# EAGLE design PowerMeter (EAGLE 7.3.0)
DATABASE: ../../../../digikeydb.txt
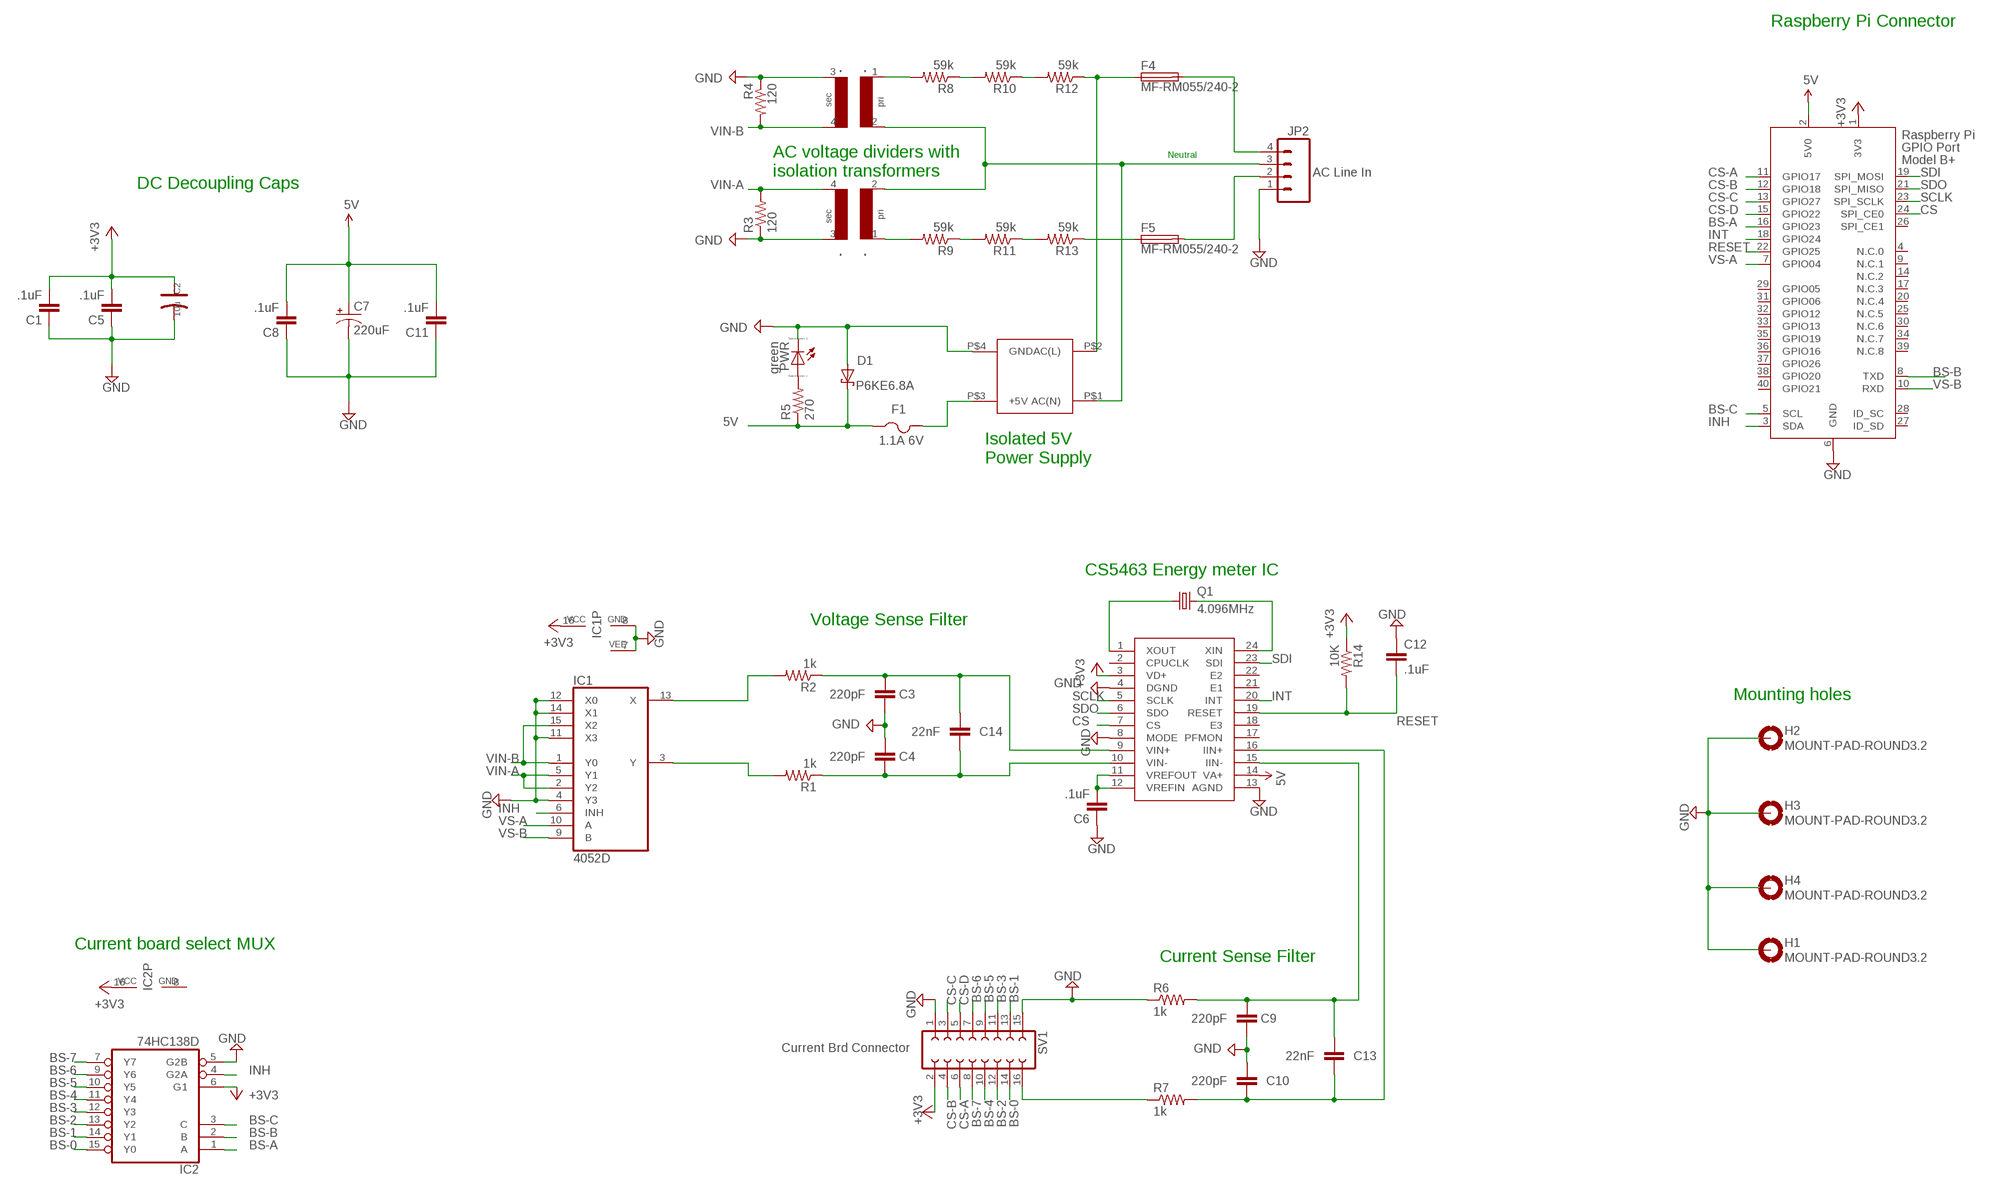
[diagram p0: schematic, sheet 1]

## Parts
C1  .1uF  C-EUC1206  [C1206]
C2  10u  CAP-AVX-C  [AVX-C]
C3  220pF  C-EUC1206  [C1206]
C4  220pF  C-EUC1206  [C1206]
C5  .1uF  C-EUC1206  [C1206]
C6  .1uF  C-EUC1206  [C1206]
C7  220uF  CPOL-USE2,5-6E  [E2,5-6E]
C8  .1uF  C-EUC1206  [C1206]
C9  220pF  C-EUC1206  [C1206]
C10  220pF  C-EUC1206  [C1206]
C11  .1uF  C-EUC1206  [C1206]
C12  .1uF  C-EUC1206  [C1206]
C13  22nF  C-EUC1206  [C1206]
C14  22nF  C-EUC1206  [C1206]
D1  P6KE6.8A  P6KEXXA  [C1702-15]
F1  1.1A 6V  PTCFUSE-1812  [1812]
F4  MF-RM055/240-2  FUSETE5  [TE5]
F5  MF-RM055/240-2  FUSETE5  [TE5]
H1  MOUNT-PAD-ROUND3.2  [3,2-PAD]
H2  MOUNT-PAD-ROUND3.2  [3,2-PAD]
H3  MOUNT-PAD-ROUND3.2  [3,2-PAD]
H4  MOUNT-PAD-ROUND3.2  [3,2-PAD]
IC1  4052D  [SO16]
IC2  74HC138D  [SO16]
JP2  AC Line In  M04  [SCREWTERMINAL-5MM-4]
PWR  green  LED_E  [LED_1206]
Q1  4.096MHz  CRYSTALHC49S  [HC49/S]
R1  1k  R-US_R1206  [R1206]
R2  1k  R-US_R1206  [R1206]
R3  120  R-US_R1206  [R1206]
R4  120  R-US_R1206  [R1206]
R5  270  R-US_R1206  [R1206]
R6  1k  R-US_R1206  [R1206]
R7  1k  R-US_R1206  [R1206]
R8  59k  R-US_R1206  [R1206]
R9  59k  R-US_R1206  [R1206]
R10  59k  R-US_R1206  [R1206]
R11  59k  R-US_R1206  [R1206]
R12  59k  R-US_R1206  [R1206]
R13  59k  R-US_R1206  [R1206]
R14  10K  R-US_R1206  [R1206]
SV1  Current Brd Connector  FE08-2  [FE08-2]
U$2  TV16E  [TV16E]
U$3  TV16E  [TV16E]
U$4  VSK-S10  [VSK-S10]
U$5  CS5463  [SSOP24]
X2  RASPI_BOARD_B+_E4  [RASPI_BOARD_B+_EDGES_4DRILL]

## Nets
5V: C7.+ C8.2 C11.2 D1.C F1.1 R5.1 U$5.14(VA+) X2.2(5V0)
+3V3: C1.2 C2.+ C5.2 IC1.16(VCC) IC2.6(G1) IC2.16(VCC) R14.1 SV1.2 U$5.3(VD+) X2.1(3V3)
+5V: F1.2 U$4.P$3(+5V)
AC1 [ac line]: R8.2 U$3.1
AC(L) [ac line]: F4.1 R12.1 U$4.P$2(AC(L))
AC(N) [ac line]: JP2.3 U$2.2 U$3.2 U$4.P$1(AC(N))
BS-0: IC2.15(Y0) SV1.14
BS-1: IC2.14(Y1) SV1.13
BS-2: IC2.13(Y2) SV1.12
BS-3: IC2.12(Y3) SV1.11
BS-4: IC2.11(Y4) SV1.10
BS-5: IC2.10(Y5) SV1.9
BS-6: IC2.9(Y6) SV1.7
BS-7: IC2.7(Y7) SV1.8
BS-A: IC2.1(A) X2.16(GPIO23)
BS-B: IC2.2(B) X2.8(TXD)
BS-C: IC2.3(C) X2.5(SCL)
C5: C10.1 C13.1 R7.2 U$5.16(IIN+)
CS: U$5.7(CS) X2.24(SPI_CE0)
CS-A: SV1.6 X2.11(GPIO17)
CS-B: SV1.4 X2.12(GPIO18)
CS-C: SV1.3 X2.13(GPIO27)
CS-D: SV1.5 X2.15(GPIO22)
GND: C1.1 C2.- C3.1 C4.2 C5.1 C6.1 C7.- C8.1 C9.1 C10.2 C11.1 C12.1 D1.A H1.B3,2(MOUNT) H2.B3,2(MOUNT) H3.B3,2(MOUNT) H4.B3,2(MOUNT) IC1.4(Y3) IC1.7(VEE) IC1.8(GND) IC1.11(X3) IC1.12(X0) IC1.14(X1) IC2.5(G2B) JP2.1 PWR.C R3.1 R4.1 R6.1 SV1.1 SV1.15 U$2.3 U$3.3 U$4.P$4(GND) U$5.4(DGND) U$5.8(MODE) U$5.13(AGND) X2.6(GND)
IIN+: R7.1 SV1.16
INH: IC1.6(INH) IC2.4(G2A) X2.3(SDA)
INT: U$5.20(INT) X2.18(GPIO24)
N$1: Q1.1 U$5.1(XOUT)
N$2 [ac line]: F5.1 R13.1
N$7: PWR.A R5.2
N$8: C9.2 C13.2 R6.2 U$5.15(IIN-)
N$9 [ac line]: F4.2 JP2.4
N$12: Q1.2 U$5.24(XIN)
N$17: C6.2 U$5.11(VREFOUT) U$5.12(VREFIN)
N$23: IC1.13(X) R2.2
N$38 [ac line]: F5.2 JP2.2
N$39: IC1.3(Y) R1.2
N$43 [ac line]: R10.1 R12.2
N$44 [ac line]: R8.1 R10.2
N$46: C4.1 C14.1 R1.1 U$5.10(VIN-)
N$48 [ac line]: R11.1 R13.2
N$49 [ac line]: R9.1 R11.2
N$51 [ac line]: R9.2 U$2.1
R1: C3.2 C14.2 R2.1 U$5.9(VIN+)
RESET: C12.2 R14.2 U$5.19(RESET) X2.22(GPIO25)
SCLK: U$5.5(SCLK) X2.23(SPI_SCLK)
SDI: U$5.23(SDI) X2.19(SPI_MOSI)
SDO: U$5.6(SDO) X2.21(SPI_MISO)
VIN-A: IC1.2(Y2) IC1.5(Y1) R3.2 U$2.4
VIN-B: IC1.1(Y0) IC1.15(X2) R4.2 U$3.4
VS-A: IC1.10(A) X2.7(GPIO04)
VS-B: IC1.9(B) X2.10(RXD)
Unconnected: U$5.2(CPUCLK) U$5.17(PFMON) U$5.18(E3) U$5.21(E1) U$5.22(E2) X2.4(N.C.0) X2.9(N.C.1) X2.14(N.C.2) X2.17(N.C.3) X2.20(N.C.4) X2.25(N.C.5) X2.26(SPI_CE1) X2.27(ID_SD) X2.28(ID_SC) X2.29(GPIO05) X2.30(N.C.6) X2.31(GPIO06) X2.32(GPIO12) X2.33(GPIO13) X2.34(N.C.7) X2.35(GPIO19) X2.36(GPIO16) X2.37(GPIO26) X2.38(GPIO20) X2.39(N.C.8) X2.40(GPIO21)

## Notes on the sheet
- Raspberry Pi Connector
- Neutral
- AC voltage dividers with
  isolation transformers
- DC Decoupling Caps
- Isolated 5V
  Power Supply
- CS5463 Energy meter IC
- Voltage Sense Filter
- Mounting holes
- Current board select MUX
- Current Sense Filter

## Power pins joined to a net without a drawn wire
GND: IC2.8(GND)

## Library data of the parts
C1 C5 C6 C8 C11 C12 = rcl:C-EU: CAPACITOR, European symbol; PARTNO: C1206C104K5RAC7867
C2 = Discrete:CAP*: Electrolytic Capacitors,Tantalum Capacitors and Super Capacitors; PARTNO: T491C106K016AT
C3 C4 C9 C10 = rcl:C-EU: CAPACITOR, European symbol; PARTNO: C1206C221J5GACTU
C7 = adafruit:CPOL-US: POLARIZED CAPACITOR, American symbol; PARTNO: ESH227M016AE3AA
C13 C14 = rcl:C-EU: CAPACITOR, European symbol; PARTNO: C1206C223K5RACTU
D1 = diode:P6KEXXA: DIODE transient-voltage suppressor; PARTNO: P6KE6.8A
F1 = adafruit:PTCFUSE: PTC fuses, resettable thermistors; PARTNO: 0ZCC0110AF2C
F4 F5 = fuse:FUSE: Fuse; OC_FARNELL: unknown; OC_NEWARK: unknown; PARTNO: MF-RM055/240-2
H1-H4 = holes:MOUNT-PAD-ROUND: MOUNTING PAD, round; BOM: EXCLUDE
IC1 = 40xx:4052: Dual 4-channel ANALOG MULTIPLEXER; PARTNO: CD4052BNSR
IC2 = 74xx-eu:74*138: 3-line to 8-line DECODER/DEMULTIPLEXER; PARTNO: SN74HC138NSR
JP2 = SparkFun-Connectors:M04: Header 4 Standard 4-pin 0.1" header. Use with straight break away headers (SKU : PRT-00116), right angle break away headers (PRT-00553), swiss pins (PRT-00743), machine pins (PRT-00117), and female headers (PRT-00115). Molex polarized connector foot print use with SKU : PRT-08231 with associated crimp pins and housings. 1MM SMD Version SKU: PRT-10208; PARTNO: 1935187
PWR = eagle-ltspice:LED_E: LED Source: http://www.osram.convergy.de Source: www.luxeon.com Source: www.kingbright.com; PARTNO: LTST-C150GKT; SPICEMODEL: NONE; SPICEPREFIX: D; SPICETYPE: diode
Q1 = crystal:CRYSTAL: CRYSTAL; OC_FARNELL: 1667008; OC_NEWARK: unknown; PARTNO: 9B-4.096MBBK-B
R1 R2 R6 R7 = resistor:R-US_: RESISTOR, American symbol; PARTNO: RC1206FR-071KL
R3 R4 = resistor:R-US_: RESISTOR, American symbol; PARTNO: RC1206FR-07120RL
R5 = resistor:R-US_: RESISTOR, American symbol; PARTNO: RC1206FR-07270RL
R8-R13 = resistor:R-US_: RESISTOR, American symbol; PARTNO: RC1206FR-0759KL
R14 = resistor:R-US_: RESISTOR, American symbol; PARTNO: RC1206FR-0710KL
SV1 = con-lsta:FE08-2: FEMALE HEADER; OC_FARNELL: unknown; OC_NEWARK: unknown; PARTNO: PPTC082LFBN-RC
U$2 U$3 = CraigJensen:TV16E: YHDC TV16E Transformer
U$4 = CraigJensen:VSK-S10; PARTNO: VSK-S5-5UA
U$5 = Cirrus_Logic_By_element14_Batch_1:CS5463; PARTNO: CS5463-ISZ
X2 = raspberrypi_bastelstube_v13:RASPI_BOARD_B+: Raspberry Pi GPIO connector with markings for the outer dimensions of the Raspberry Pi board model B+ with different sets of drill holes or mounting pads; PARTNO: M20-9762046

## Net classes
1 ac line: width 0.4 mm, clearance 1.2 mm

## Board
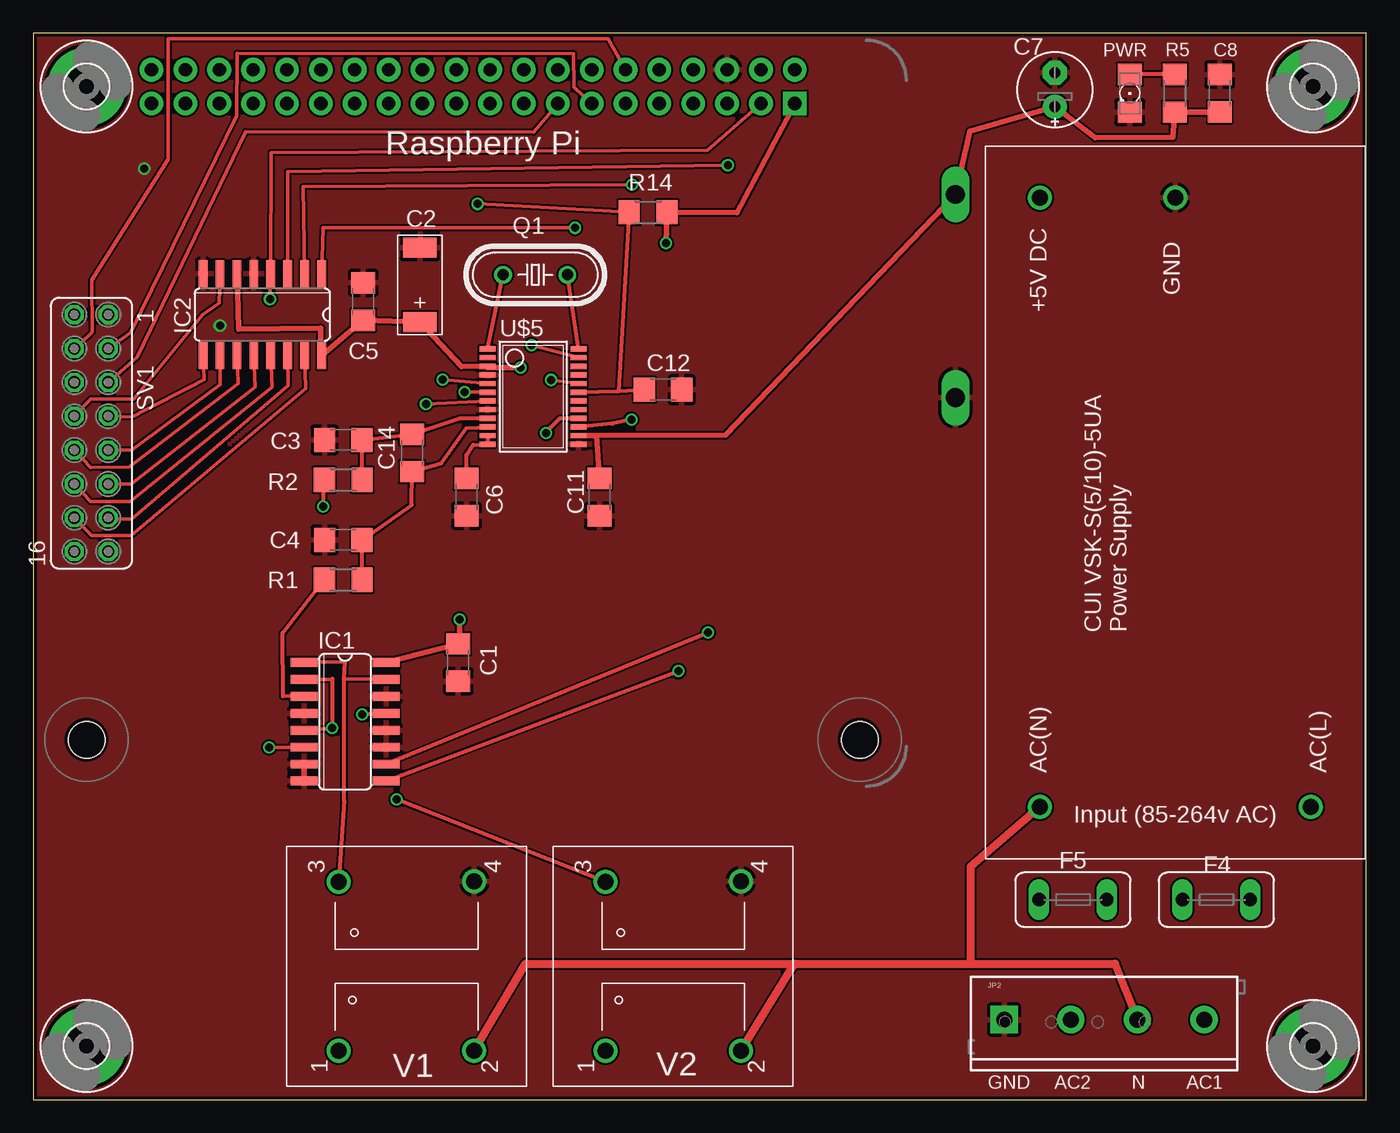
[diagram p1: board, top side]
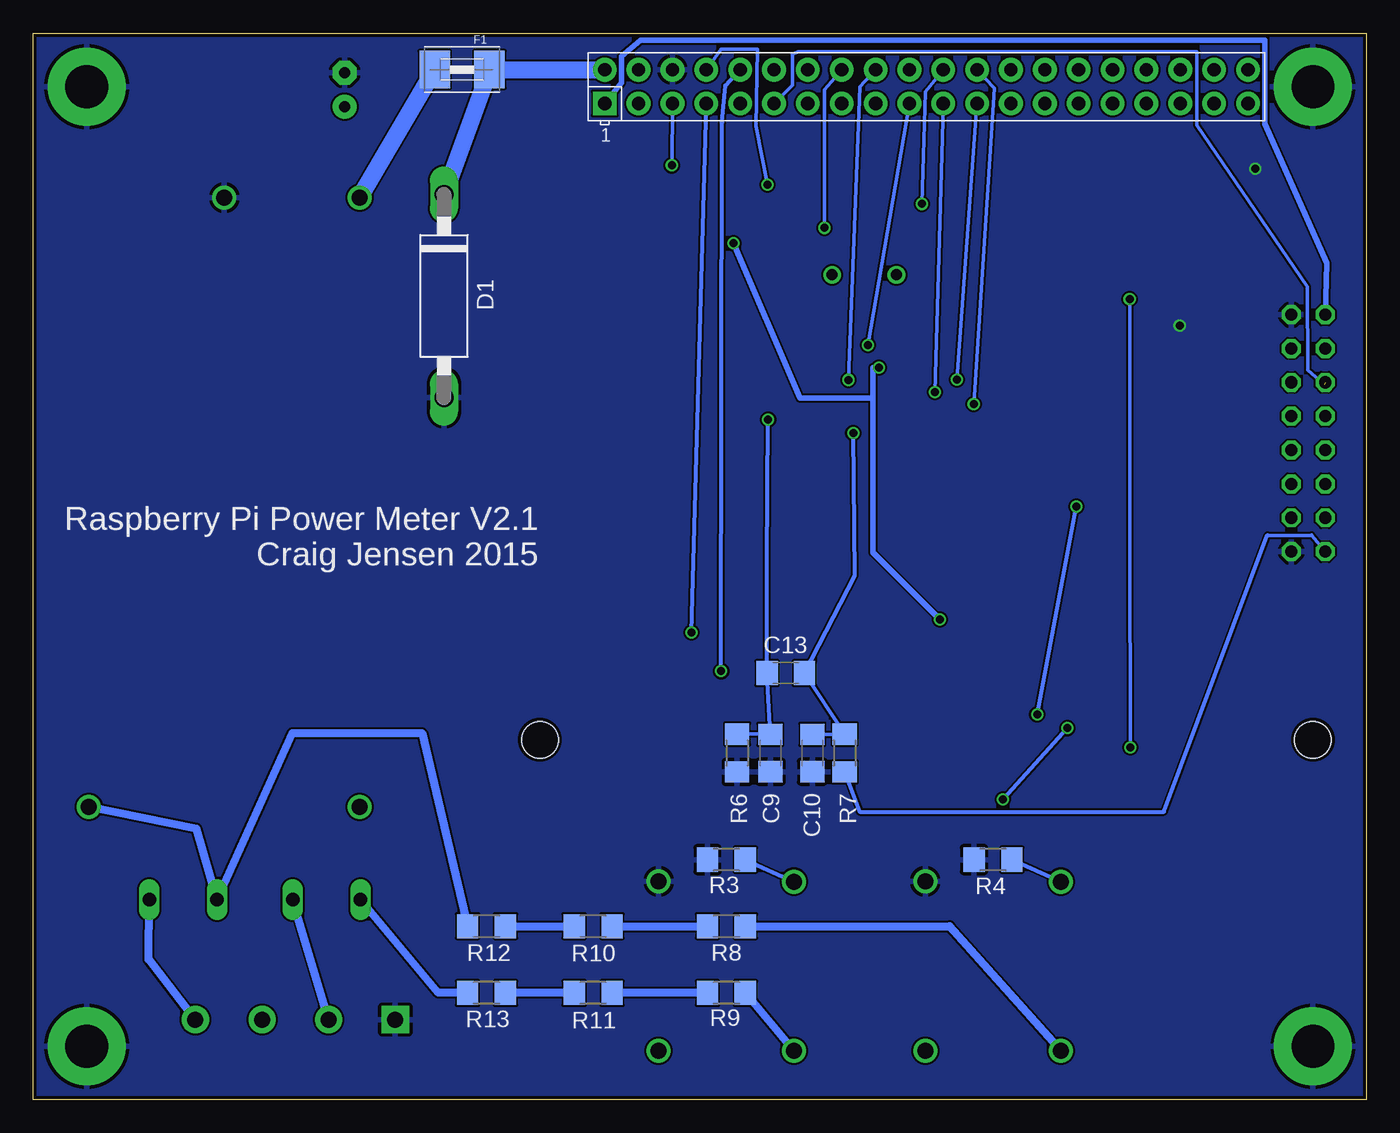
[diagram p2: board, bottom side, seen from below]

Size 100 x 80 mm. Coordinates in mm from the lower left corner, seen from the top.
Outline: 0,0 100,0 100,80 0,80 0,0
Copper layers (1*16): Top 0.035mm / dielectric 1.5mm / Bottom 0.035mm
Design rules "Elecrow_2-layer_eagle_rule": minimum track width 6mil, minimum drill 12mil, track to track 6mil, track to pad 6mil, pad to pad 6mil, via to via 6mil, smd to smd 0mil, copper to edge 10mil, drill to drill 10mil, minimum pad ring 10mil, minimum via ring 6mil, stop-mask expansion 2mil, vias tented up to drill 100mil, thermal gap 10mil

### Footprints (pad centres in the part's own frame; a part is rotated, then mirrored left to right if it is on the bottom)
C1206 = smd 1.6 x 1.8: 1 -1.4,0; 2 1.4,0
AVX-C = smd 1.524 x 2.54: + -2.794,0; - 2.794,0
E2,5-6E = drill 0.813 pad 1.778: + -1.27,0 | drill 0.813 pad 1.778 octagon: - 1.27,0
C1702-15 = drill 1.397 long: A 7.62,0; C -7.62,0
1812 = smd 2.286 x 2.794: 1 -2.046,0; 2 2.046,0
TE5 = drill 1.016 long: 1 -2.54,0; 2 2.54,0
3,2-PAD = drill 3.2 pad 5.842: B3,2 0,0
SO16 = smd 0.66 x 2.032: 1 -4.445,-3.073; 2 -3.175,-3.073; 3 -1.905,-3.073; 4 -0.635,-3.073; 5 0.635,-3.073; 6 1.905,-3.073; 7 3.175,-3.073; 8 4.445,-3.073; 9 4.445,3.073; 10 3.175,3.073; 11 1.905,3.073; 12 0.635,3.073; 13 -0.635,3.073; 14 -1.905,3.073; 15 -3.175,3.073; 16 -4.445,3.073
SCREWTERMINAL-5MM-4 = drill 1.2 pad 2.032 square: 1 2.5,4 | drill 1.2 pad 2.032: 2 7.5,4; 3 12.5,4; 4 17.5,4
LED_1206 = smd 1.6 x 1.803: A -1.422,0; C 1.422,0
HC49/S = drill 0.813: 1 -2.413,0; 2 2.413,0
R1206 = smd 1.6 x 1.803: 1 -1.422,0; 2 1.422,0
FE08-2 = drill 0.914 octagon: 1 -8.89,1.27; 2 -8.89,-1.27; 3 -6.35,1.27; 4 -6.35,-1.27; 5 -3.81,1.27; 6 -3.81,-1.27; 7 -1.27,1.27; 8 -1.27,-1.27; 9 1.27,1.27; 10 1.27,-1.27; 11 3.81,1.27; 12 3.81,-1.27; 13 6.35,1.27; 14 6.35,-1.27; 15 8.89,1.27; 16 8.89,-1.27
TV16E = drill 1.2: 1 -6.35,5.08; 2 -6.35,-5.08; 3 6.36,-5.08; 4 6.35,5.08
VSK-S10 = drill 1.2: P$1 -22.86,10.16; P$2 -22.86,-10.16; P$3 22.86,10.16; P$4 22.86,0
SSOP24 = smd 0.4 x 1.2: 1 -3.575,-3.42; 2 -2.925,-3.42; 3 -2.275,-3.42; 4 -1.625,-3.42; 5 -0.975,-3.42; 6 -0.325,-3.42; 7 0.325,-3.42; 8 0.975,-3.42; 9 1.625,-3.42; 10 2.275,-3.42; 11 2.925,-3.42; 12 3.575,-3.42; 13 3.575,3.42; 14 2.925,3.42; 15 2.275,3.42; 16 1.625,3.42; 17 0.975,3.42; 18 0.325,3.42; 19 -0.325,3.42; 20 -0.975,3.42; 21 -1.625,3.42; 22 -2.275,3.42; 23 -2.925,3.42; 24 -3.575,3.42
RASPI_BOARD_B+_EDGES_4DRILL = drill 1 pad 1.778 square: 1 8.37,51.23 | drill 1 pad 1.778: 2 8.37,53.77; 3 10.91,51.23; 4 10.91,53.77; 5 13.45,51.23; 6 13.45,53.77; 7 15.99,51.23; 8 15.99,53.77; 9 18.53,51.23; 10 18.53,53.77; 11 21.07,51.23; 12 21.07,53.77; 13 23.61,51.23; 14 23.61,53.77; 15 26.15,51.23; 16 26.15,53.77; 17 28.69,51.23; 18 28.69,53.77; 19 31.23,51.23; 20 31.23,53.77; 21 33.77,51.23; 22 33.77,53.77; 23 36.31,51.23; 24 36.31,53.77; 25 38.85,51.23; 26 38.85,53.77; 27 41.39,51.23; 28 41.39,53.77; 29 43.93,51.23; 30 43.93,53.77; 31 46.47,51.23; 32 46.47,53.77; 33 49.01,51.23; 34 49.01,53.77; 35 51.55,51.23; 36 51.55,53.77; 37 54.09,51.23; 38 54.09,53.77; 39 56.63,51.23; 40 56.63,53.77 | hole 2.75: 61.5,3.5; 3.5,3.5

### Placement (x,y rotation side)
C1  31.88,32.78 90 top
C2  29,61.12 90 top
C3  23.25,49.5 0 top
C4  23.25,42 180 top
C5  24.75,59.88 270 top
C6  32.5,45.2 90 top
C7  76.64,75.77 90 top
C8  89,75.5 270 top
C9  44.7,26 90 bottom
C10  41.55,26 270 bottom
C11  42.48,45.2 90 top
C12  47.24,53.26 180 top
C13  43.55,32 180 bottom
C14  28.41,48.52 90 top
D1  69.19,60.28 270 bottom
F1  67.83,77.28 180 bottom
F4  88.76,15 0 top
F5  78,15 0 top
H1  4,76 0 top
H2  96,76 0 top
H3  96,4 0 top
H4  4,4 0 top
IC1  23.39,28.34 270 top
IC2  17.18,58.89 180 top
JP2  70.34,2 0 top
PWR  82.27,75.5 270 top
Q1  37.66,61.88 0 top
R1  23.25,39 180 top
R2  23.25,46.5 180 top
R3  48,18 0 bottom
R4  28,18 0 bottom
R5  85.63,75.5 90 top
R6  47.2,26 90 bottom
R7  39.12,26 90 bottom
R8  48,13 0 bottom
R9  48,8 0 bottom
R10  58,13 0 bottom
R11  58,8 0 bottom
R12  66,13 0 bottom
R13  66,8 0 bottom
R14  46.12,66.57 180 top
SV1  4.35,50 270 top
U$2  48,10 90 top
U$3  28,10 90 top
U$4  85.67,44.8 90 top
U$5  37.5,52.75 270 top
X2  65.5,23.5 0 bottom

### Tracks (layer width: path | path; a pad name or v marks a point on that pad's centre or on a via)
5V
  Top 0.406: U$5.14 42.25,49.83 | 42.25,49.83 51.92,49.84 D1.C 70.26,72.66 C7.+ 79.69,72.18 85.5,72.22 R5.1 C8.2 | C11.2 42.25,49.83
  Bottom 1.27: X2.2 F1.1 D1.C
+3V3  (via drill 0.6)
  Top 0.406: v47.47,64.24 R14.1 52.8,66.53 X2.1 | IC1.16 C1.2 31.97,34.19 v31.97,36.02 | IC2.6 15.4,57.81 21.56,57.9 21.56,55.07 IC2.16 C5.2 C2.+ 32.12,55 U$5.3 34.08,54.93 v36.55,54.93
  Bottom 0.406: v47.47,64.24 42.47,52.63 36.99,52.63 | SV1.2 2.97,62.77 7.62,73.2 7.62,79.5 54.46,79.5 55.86,78.3 55.87,76.3 X2.1 | v31.97,36.02 36.99,41.04 36.99,52.63 | 36.99,52.63 36.99,54.93 v36.55,54.93
+5V
  Bottom 1.27: U$4.P$3 F1.2
AC1
  Bottom 0.61: R8.2 31.26,13 U$3.1
AC(L)
  Bottom 0.61: U$4.P$2 87.76,20.31 F4.1 80.55,27.49 70.85,27.49 R12.1
AC(N)
  Top 0.61: U$3.2 36.94,10.2 57.11,10.2 | 57.11,10.2 70.31,10.2 | 70.31,10.2 81.16,10.2 JP2.3 | U$2.2 57.11,10.2 | U$4.P$1 70.31,17.46 70.31,10.2
BS-0
  Top 0.254: IC2.15 20.43,53.34 7.33,42.32 4.38,42.33 SV1.14
BS-1
  Top 0.254: IC2.14 19.12,53.58 7.38,43.57 5.7,43.57 SV1.13
BS-2
  Top 0.254: IC2.13 17.93,53.47 7.26,44.87 4.3,44.87 SV1.12
BS-3
  Top 0.254: IC2.12 16.63,53.46 7.34,46.2 SV1.11
BS-4
  Top 0.254: IC2.11 15.38,53.7 7.21,47.45 4.3,47.41 SV1.10
BS-5
  Top 0.254: IC2.10 14,53.65 7.38,48.73 SV1.9
BS-6
  Top 0.254: IC2.9 12.81,54.02 7.38,51.23 SV1.7
BS-7
  Top 0.254: IC2.7 13.94,59.77 12.69,58.9 7.53,52.55 4.3,52.55 SV1.8
BS-A  (via drill 0.6)
  Top 0.254: v40.64,65.4 21.75,65.4 IC2.1
  Bottom 0.254: X2.16 40.64,75.76 v40.64,65.4
BS-B  (via drill 0.6)
  Top 0.254: IC2.2 20.26,68.5 v44.92,68.63
  Bottom 0.254: v44.92,68.63 45.79,73.03 45.66,78.8 48.39,78.8 X2.8
BS-C  (via drill 0.6)
  Top 0.254: IC2.3 19.08,69.62 v52.1,70.09
  Bottom 0.254: v52.1,70.09 X2.5
C5  (via drill 0.6)
  Top 0.305: v38.48,49.99 38.48,50.09 39.53,51.13 U$5.16
  Bottom 0.305: v38.48,49.99 38.36,39.32 C13.1 R7.2 C10.1
CS  (via drill 0.6)
  Top 0.254: v29.45,52.18 U$5.7
  Bottom 0.254: X2.24 27.88,75.88 v29.45,52.18
CS-A  (1 unrouted)
  Bottom 0.254: 3.13,53.65 4.37,54.72 4.42,60.99 12.7,73.09 12.72,78.61 42.62,78.61 43.06,78.42 43.06,76.1 X2.11
CS-B
  Top 0.254: X2.12 43.13,79.6 10.11,79.6 10.13,70.55 4.37,61.5 4.43,57.58 4.16,57.32 SV1.4
CS-C
  Top 0.254: X2.13 40.58,75.94 40.52,78.48 15.3,78.49 15.24,73.81 7.32,57.54 SV1.3
CS-D
  Top 0.254: X2.15 37.53,72.6 15.94,72.61 7.78,55.7 SV1.5
GND  (via drill 0.6)
  Top 0.406: IC1.7 IC1.8
  other vias: 14,58.08 8.33,69.86
  pour Bottom: 101.38,81.12 101.86,-1 -1.12,-0.88 -1,34 -0.88,81.12
  pour Top: 101.38,81.25 101.31,-1 -2,-0.75 -2,81.25
IIN+
  Bottom 0.254: 4.1,42.32 SV1.16
  Bottom 0.305: R7.1 37.99,21.6 15.17,21.6 7.41,42.35 4.1,42.32
INH  (via drill 0.6)
  Top 0.254: IC1.6 v17.7,26.41 | v17.75,60.06 IC2.4 17.84,71.05 50.57,71.25 X2.3
  Bottom 0.254: v17.75,60.06 17.75,42.12 v17.7,26.41
INT  (via drill 0.6)
  Top 0.254: v38.84,54 U$5.20
  Bottom 0.254: X2.18 37.99,76.01 v38.84,54
N$1
  Top 0.305: U$5.1 Q1.1
N$2
  Bottom 0.61: R13.1 69.63,8.02 F5.1
N$7
  Top 0.305: R5.2 PWR.A
N$8  (via drill 0.6)
  Top 0.305: v44.87,51.03 43.43,50.7 U$5.15
  Bottom 0.305: v44.87,51.03 44.96,40.28 C13.2 C9.2 R6.2
N$9
  Bottom 0.61: JP2.4 91.35,10.51 F4.2
N$12
  Top 0.305: U$5.24 Q1.2
N$17
  Top 0.305: U$5.11 U$5.12 33,49.12 32.5,48.38 C6.2
N$23  (via drill 0.6)
  Top 0.305: IC1.13 v24.68,28.89 | v21.75,44.5 R2.2
  Bottom 0.305: v24.68,28.89 v21.75,44.5
N$38
  Bottom 0.61: JP2.2 F5.2
N$39
  Top 0.305: IC1.3 18.73,30.27 18.7,34.98 R1.2
N$43
  Bottom 0.61: R12.2 R10.1
N$44
  Bottom 0.61: R10.2 R8.1
N$46
  Top 0.305: R1.1 C4.1 28.39,44.62 C14.1 30.62,47.75 32.5,50.38 U$5.10
N$48
  Bottom 0.61: R11.1 R13.2
N$49
  Bottom 0.61: R9.1 R11.2
N$51
  Bottom 0.61: U$2.1 R9.2
R1
  Top 0.305: R2.1 C3.2 C14.2 32,51.12 U$5.9
RESET  (via drill 0.6)
  Top 0.254: v33.33,67.2 R14.2
  Top 0.305: U$5.19 43.89,53.15 | 43.89,53.15 C12.2 | R14.2 43.89,53.15
  Bottom 0.254: X2.22 33.06,75.63 v33.33,67.2
SCLK  (via drill 0.6)
  Top 0.254: v30.7,54.02 U$5.5
  Bottom 0.254: X2.23 v30.7,54.02
SDI  (via drill 0.6)
  Top 0.254: v37.39,56.6 U$5.23
  Bottom 0.254: X2.19 v37.39,56.6
SDO  (via drill 0.6)
  Top 0.254: U$5.6 v32.36,53.07
  Bottom 0.254: v32.36,53.07 X2.21
VIN-A  (via drill 0.6)
  Top 0.305: IC1.5 v22.41,27.86 22.43,31.57 IC1.2 | U$2.4 v27.25,22.51
  Bottom 0.305: v22.41,27.86 v27.25,22.51 | R3.2 U$2.4
VIN-B
  Top 0.305: 23.3,31.57 23.32,22.44 U$3.4 | 23.3,31.57 23.38,32.83 IC1.1 | IC1.15 23.3,31.57
  Bottom 0.305: U$3.4 R4.2
VS-A  (via drill 0.6)
  Top 0.305: IC1.10 v50.62,35.03
  Bottom 0.305: v50.62,35.03 X2.7
VS-B  (via drill 0.6)
  Top 0.305: IC1.9 v48.39,32.14
  Bottom 0.305: v48.39,32.14 48.32,73.33 48.08,76.07 X2.10

### Text on the board
tNames: Raspberry Pi | V1 | V2 | GND | AC2 | N | AC1
bNames: Raspberry Pi Power Meter V2.1 / Craig Jensen 2015